# EAGLE design untitled (EAGLE 5.10)
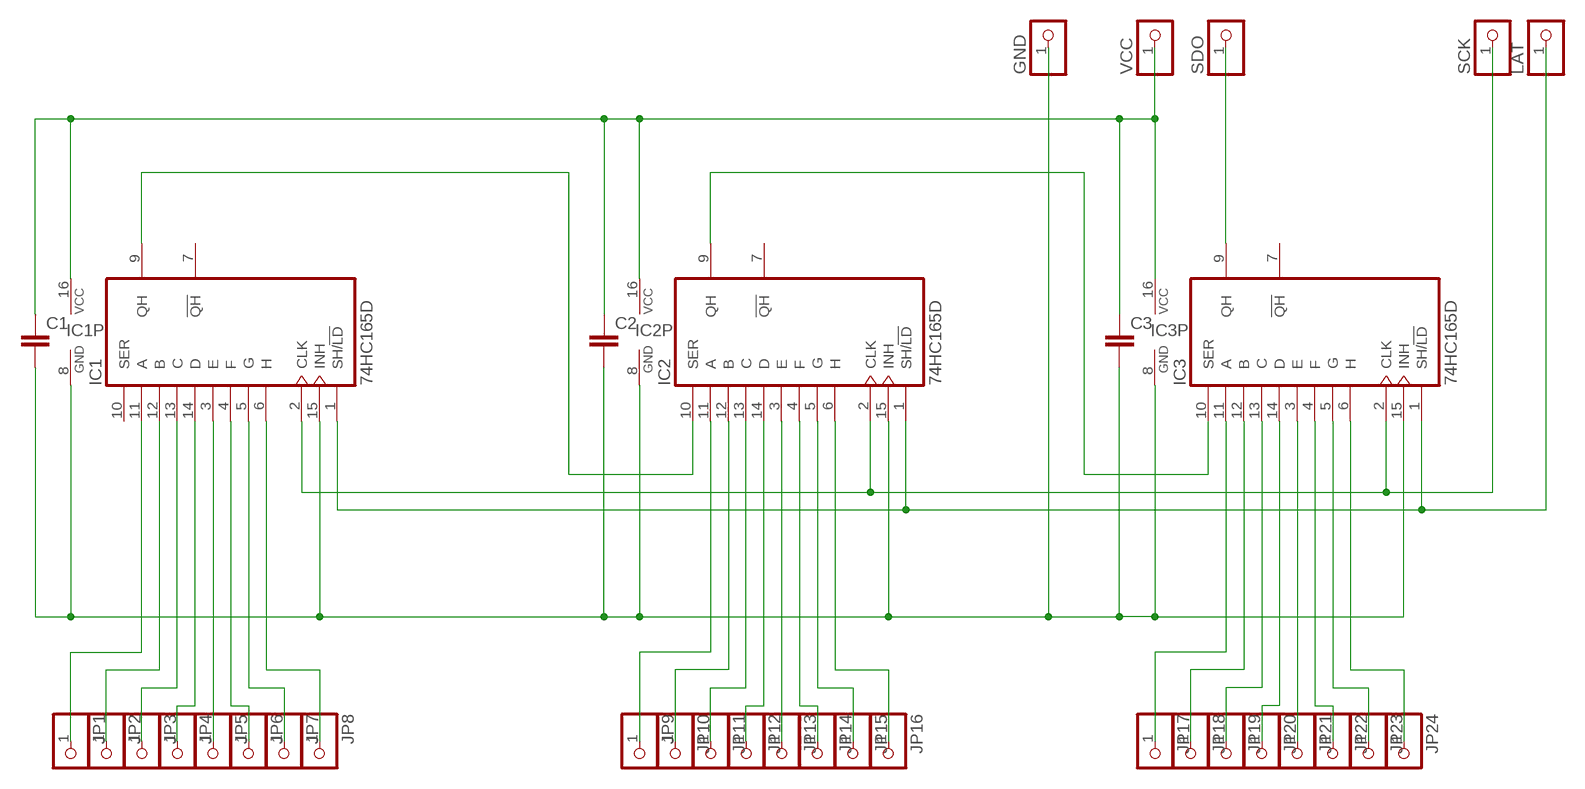
[diagram p0: schematic, sheet 1]

## Parts
C1  C-EUC0805  [C0805]
C2  C-EUC0805  [C0805]
C3  C-EUC0805  [C0805]
GND  PINHD-1X1  [1X01]
IC1  74HC165D  [SO16]
IC2  74HC165D  [SO16]
IC3  74HC165D  [SO16]
JP1  PINHD-1X1  [1X01]
JP2  PINHD-1X1  [1X01]
JP3  PINHD-1X1  [1X01]
JP4  PINHD-1X1  [1X01]
JP5  PINHD-1X1  [1X01]
JP6  PINHD-1X1  [1X01]
JP7  PINHD-1X1  [1X01]
JP8  PINHD-1X1  [1X01]
JP9  PINHD-1X1  [1X01]
JP10  PINHD-1X1  [1X01]
JP11  PINHD-1X1  [1X01]
JP12  PINHD-1X1  [1X01]
JP13  PINHD-1X1  [1X01]
JP14  PINHD-1X1  [1X01]
JP15  PINHD-1X1  [1X01]
JP16  PINHD-1X1  [1X01]
JP17  PINHD-1X1  [1X01]
JP18  PINHD-1X1  [1X01]
JP19  PINHD-1X1  [1X01]
JP20  PINHD-1X1  [1X01]
JP21  PINHD-1X1  [1X01]
JP22  PINHD-1X1  [1X01]
JP23  PINHD-1X1  [1X01]
JP24  PINHD-1X1  [1X01]
LAT  PINHD-1X1  [1X01]
SCK  PINHD-1X1  [1X01]
SDO  PINHD-1X1  [1X01]
VCC  PINHD-1X1  [1X01]

## Nets
GND: C1.2 C2.2 C3.2 GND.1 IC1.8(GND) IC1.15(INH) IC2.8(GND) IC2.15(INH) IC3.8(GND) IC3.15(INH)
N$4: IC1.11(A) JP1.1
N$5: IC1.1(SH/!LD) IC2.1(SH/!LD) IC3.1(SH/!LD) LAT.1
N$6: IC1.9(QH) IC2.10(SER)
N$7: IC2.9(QH) IC3.10(SER)
N$8: IC1.12(B) JP2.1
N$9: IC1.13(C) JP3.1
N$10: IC1.14(D) JP4.1
N$11: IC1.3(E) JP5.1
N$12: IC1.4(F) JP6.1
N$13: IC1.5(G) JP7.1
N$14: IC1.6(H) JP8.1
N$15: IC2.11(A) JP9.1
N$16: IC2.12(B) JP10.1
N$17: IC2.13(C) JP11.1
N$18: IC2.14(D) JP12.1
N$19: IC2.3(E) JP13.1
N$20: IC2.4(F) JP14.1
N$21: IC2.5(G) JP15.1
N$22: IC2.6(H) JP16.1
N$23: IC3.3(E) JP21.1
N$24: IC3.14(D) JP20.1
N$25: IC3.13(C) JP19.1
N$26: IC3.12(B) JP18.1
N$27: IC3.11(A) JP17.1
N$28: IC3.4(F) JP22.1
N$29: IC3.5(G) JP23.1
N$30: IC3.6(H) JP24.1
SCK: IC1.2(CLK) IC2.2(CLK) IC3.2(CLK) SCK.1
SDO: IC3.9(QH) SDO.1
VDD: C1.1 C2.1 C3.1 IC1.16(VCC) IC2.16(VCC) IC3.16(VCC) VCC.1
Unconnected: IC1.7(!QH) IC1.10(SER) IC2.7(!QH) IC3.7(!QH)

## Library data of the parts
C1-C3 = rcl:C-EU: CAPACITOR, European symbol
GND JP1-JP24 LAT SCK SDO VCC = adafruit:PINHD-1X1: Pin header 1x1 for 0.1" spacing With round pins
IC1-IC3 = 74xx-eu:74*165: 8-bit parallel load SHIFT REGISTER

## Board
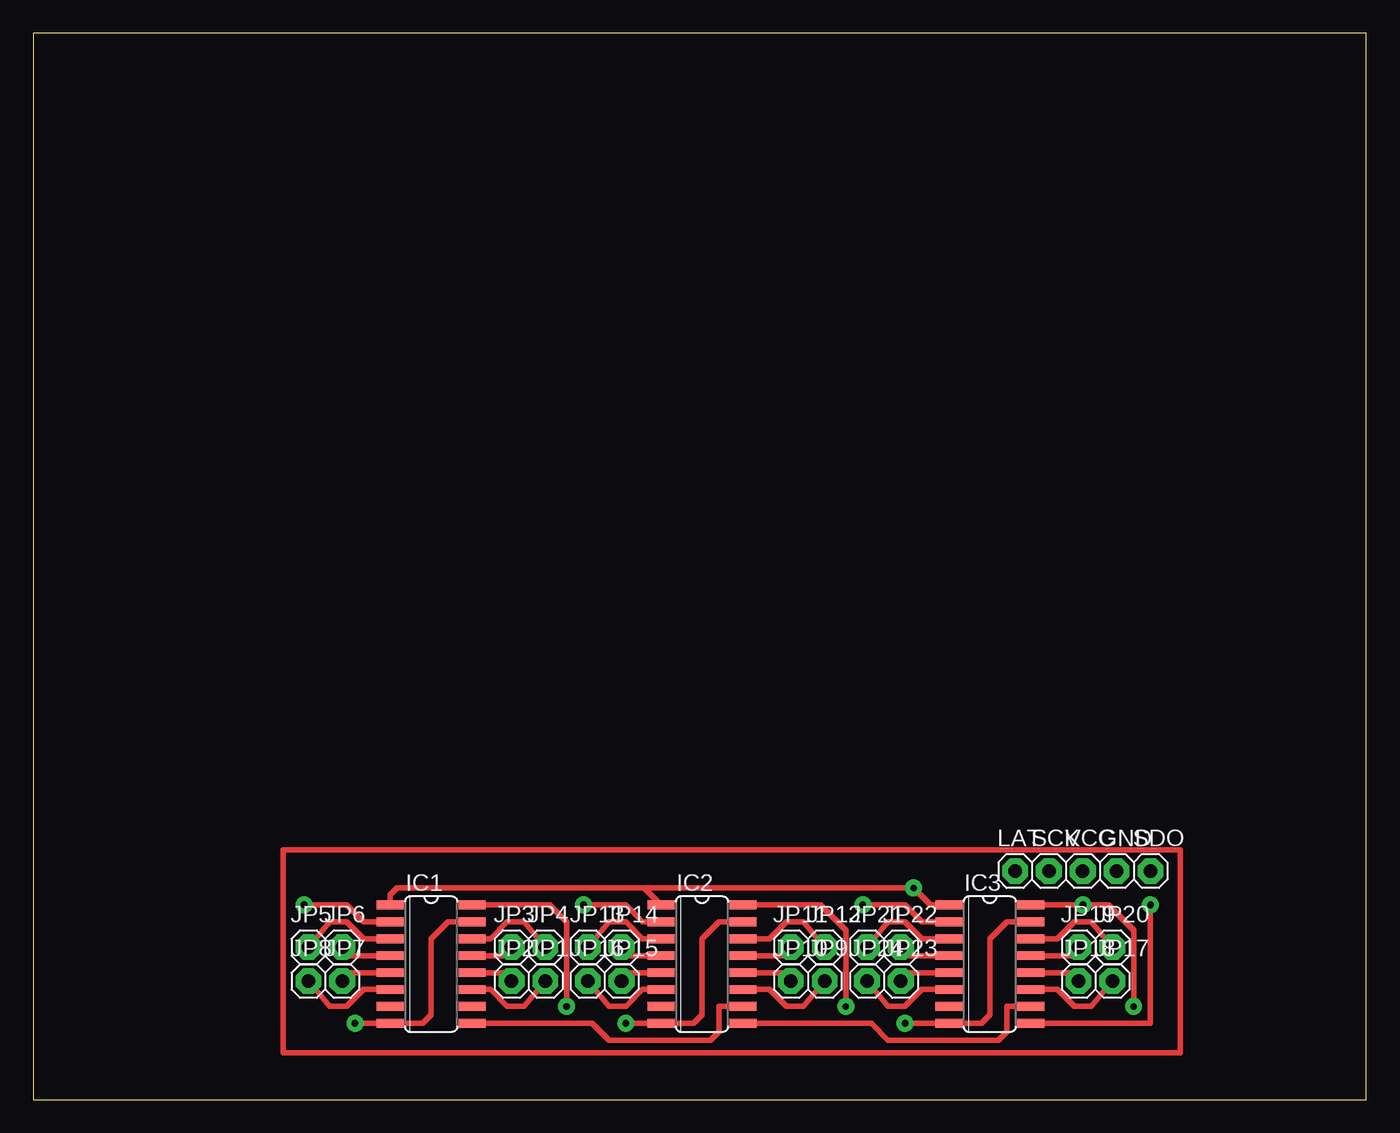
[diagram p1: board, top side]
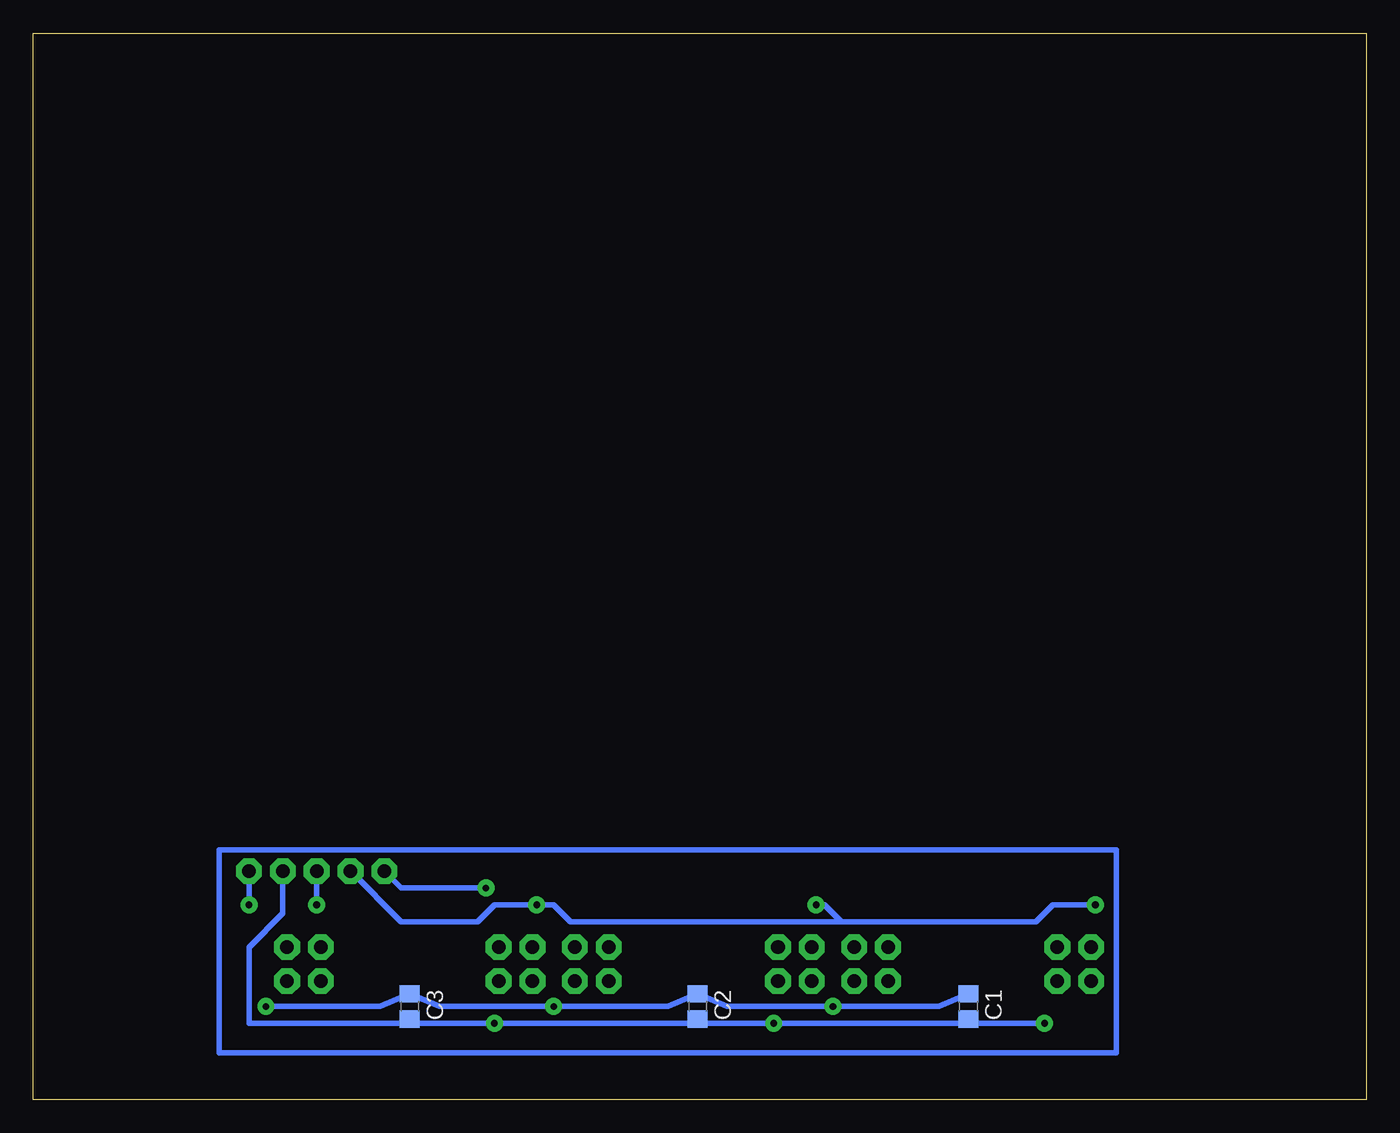
[diagram p2: board, bottom side, seen from below]

Size 100 x 80 mm. Coordinates in mm from the lower left corner, seen from the top.
Outline: 0,0 100,0 100,80 0,80 0,0
Copper layers (1*16): Top 0.035mm / dielectric 1.5mm / Bottom 0.035mm
Design rules "default": minimum track width 10mil, minimum drill 24mil, track to track 8mil, track to pad 8mil, pad to pad 8mil, via to via 8mil, smd to smd 8mil, copper to edge 40mil, drill to drill 8mil, minimum pad ring 10mil, minimum via ring 8mil, stop-mask expansion 4mil, vias tented up to drill 0mil, thermal gap 10mil

### Footprints (pad centres in the part's own frame; a part is rotated, then mirrored left to right if it is on the bottom)
C0805 = smd 1.3 x 1.5: 1 -0.95,0; 2 0.95,0
1X01 = drill 1.016 pad 1.93 octagon: 1 0,0
SO16 = smd 0.66 x 2.032: 1 -4.445,-3.073; 2 -3.175,-3.073; 3 -1.905,-3.073; 4 -0.635,-3.073; 5 0.635,-3.073; 6 1.905,-3.073; 7 3.175,-3.073; 8 4.445,-3.073; 9 4.445,3.073; 10 3.175,3.073; 11 1.905,3.073; 12 0.635,3.073; 13 -0.635,3.073; 14 -1.905,3.073; 15 -3.175,3.073; 16 -4.445,3.073

### Placement (x,y rotation side)
C1  29.84,6.99 270 bottom
C2  50.16,6.99 270 bottom
C3  71.75,6.99 270 bottom
GND  81.28,17.14 0 top
IC1  29.84,10.16 270 top
IC2  50.16,10.16 270 top
IC3  71.75,10.16 270 top
JP1  38.42,8.89 0 top
JP2  35.88,8.89 0 top
JP3  35.88,11.43 0 top
JP4  38.42,11.43 0 top
JP5  20.64,11.43 0 top
JP6  23.18,11.43 0 top
JP7  23.18,8.89 0 top
JP8  20.64,8.89 0 top
JP9  59.37,8.89 0 top
JP10  56.83,8.89 0 top
JP11  56.83,11.43 0 top
JP12  59.37,11.43 0 top
JP13  41.59,11.43 0 top
JP14  44.13,11.43 0 top
JP15  44.13,8.89 0 top
JP16  41.59,8.89 0 top
JP17  80.96,8.89 0 top
JP18  78.42,8.89 0 top
JP19  78.42,11.43 0 top
JP20  80.96,11.43 0 top
JP21  62.55,11.43 0 top
JP22  65.09,11.43 0 top
JP23  65.09,8.89 0 top
JP24  62.55,8.89 0 top
LAT  73.66,17.14 0 top
SCK  76.2,17.14 0 top
SDO  83.82,17.14 0 top
VCC  78.74,17.14 0 top

### Tracks (layer width: path | path; a pad name or v marks a point on that pad's centre or on a via)
GND  (via drill 0.5 pad 1.27)
  Top 0.406: v24.13,5.71 IC1.8 29.21,5.71 29.84,6.35 29.84,12.06 31.11,13.34 IC1.15 | IC2.8 v44.45,5.71 49.53,5.71 50.16,6.35 50.16,12.06 51.44,13.34 IC2.15 | v65.41,5.71 IC3.8 71.12,5.71 71.75,6.35 71.75,12.06 73.03,13.34 IC3.15
  Bottom 0.406: v24.13,5.71 29.52,5.71 C1.2 30.16,5.71 v44.45,5.71 49.84,5.71 C2.2 50.48,5.71 71.75,5.71 C3.2 | v65.41,5.71 71.44,5.71 C3.2 | GND.1 81.28,13.97 83.82,11.43 83.82,5.71 72.08,5.71 C3.2
N$2
  Top 0.406: 18.73,3.49 86.04,3.49 86.04,18.73 18.73,18.73 18.73,3.49
N$3
  Bottom 0.406: 18.73,3.49 18.73,18.73 86.04,18.73 86.04,3.49 18.73,3.49
N$4
  Top 0.406: IC1.11 34.29,8.26 35.56,6.99 36.83,6.99 JP1.1
N$5  (via drill 0.5 pad 1.27)
  Top 0.406: IC1.1 26.77,15.34 27.3,15.88 45.82,15.88 | 45.82,15.88 IC2.1 | IC3.1 67.31,14.61 v66.04,15.88 45.82,15.88
  Bottom 0.406: LAT.1 72.39,15.88 v66.04,15.88
N$6
  Top 0.406: 53.34,6.99 IC2.10 51.44,6.99 51.44,5.08 50.8,4.45 43.18,4.45 41.91,5.71 IC1.9
N$7
  Top 0.406: IC2.9 62.87,5.71 64.14,4.45 72.39,4.45 73.03,5.08 73.03,6.99 IC3.10
N$8
  Top 0.406: IC1.12 35.56,9.53 JP2.1
N$9
  Top 0.406: IC1.13 35.56,10.79 JP3.1
N$10
  Top 0.406: IC1.14 34.29,12.06 35.56,13.34 36.83,13.34 JP4.1
N$11
  Top 0.406: JP5.1 22.23,13.34 23.5,13.34 24.77,12.06 IC1.3 27.3,12.06
N$12
  Top 0.406: JP6.1 23.5,10.79 IC1.4
N$13
  Top 0.406: JP7.1 23.5,9.53 IC1.5
N$14
  Top 0.406: JP8.1 22.23,6.99 23.5,6.99 24.77,8.26 IC1.6
N$15
  Top 0.406: IC2.11 55.24,8.26 56.52,6.99 57.78,6.99 JP9.1
N$16
  Top 0.406: IC2.12 56.52,9.53 JP10.1
N$17
  Top 0.406: IC2.13 56.52,10.79 JP11.1
N$18
  Top 0.406: IC2.14 55.24,12.06 56.52,13.34 57.78,13.34 JP12.1
N$19
  Top 0.406: JP13.1 43.18,13.34 44.45,13.34 45.72,12.06 IC2.3
N$20
  Top 0.406: JP14.1 44.45,10.79 IC2.4
N$21
  Top 0.406: IC2.5 44.45,9.53 JP15.1
N$22
  Top 0.406: JP16.1 43.18,6.99 44.45,6.99 45.72,8.26 IC2.6
N$23
  Top 0.406: JP21.1 64.14,13.34 65.41,13.34 66.67,12.06 IC3.3
N$24
  Top 0.406: IC3.14 76.83,12.06 78.11,13.34 79.38,13.34 JP20.1
N$25
  Top 0.406: IC3.13 78.11,10.79 JP19.1
N$26
  Top 0.406: IC3.12 78.11,9.53 JP18.1
N$27
  Top 0.406: IC3.11 76.83,8.26 78.11,6.99 79.38,6.99 JP17.1
N$28
  Top 0.406: IC3.4 65.41,10.79 JP22.1
N$29
  Top 0.406: IC3.5 65.41,9.53 JP23.1
N$30
  Top 0.406: JP24.1 64.14,6.99 65.41,6.99 66.67,8.26 IC3.6
SCK  (via drill 0.5 pad 1.27)
  Top 0.406: IC2.2 45.72,13.34 44.45,14.61 v41.27,14.61 | IC1.2 24.77,13.34 23.5,14.61 v20.32,14.61 | IC3.2 66.67,13.34 65.41,14.61 v62.23,14.61
  Bottom 0.406: v41.27,14.61 40.64,14.61 39.37,13.34 | v20.32,14.61 23.5,14.61 24.77,13.34 39.37,13.34 | 39.37,13.34 59.69,13.34 60.96,14.61 v62.23,14.61 65.41,14.61 66.67,13.34 72.39,13.34 SCK.1
SDO  (via drill 0.5 pad 1.27)
  Top 0.406: IC3.9 83.82,5.71 v83.82,14.61
  Bottom 0.406: v83.82,14.61 SDO.1
VDD  (via drill 0.5 pad 1.27)
  Top 0.406: IC1.16 38.73,14.61 40.01,13.34 v40.01,6.99 | IC2.16 59.05,14.61 60.96,12.7 v60.96,6.99 | v82.55,6.99 82.55,12.7 80.64,14.61 v78.74,14.61 IC3.16
  Bottom 0.406: C1.1 32.06,6.99 v40.01,6.99 47.95,6.99 C2.1 52.38,6.99 v60.96,6.99 69.53,6.99 C3.1 73.97,6.99 v82.55,6.99 | v78.74,14.61 VCC.1